# EAGLE design bpf (EAGLE 9.6.2)
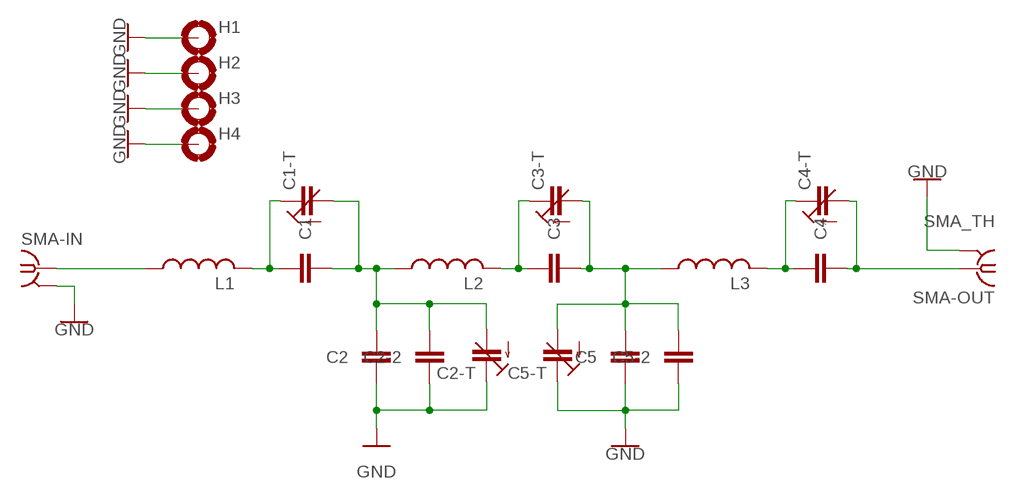
[diagram p0: schematic, sheet 1]

## Parts
C1  C_0805_PTH  [C0805K]
C1-T  C_TRIM_TH  [CTRIM3050.505]
C2  C_0805_PTH  [C0805K]
C2-2  C_0805_PTH  [C0805K]
C2-T  C_TRIM_TH  [CTRIM3050.505]
C3  C_0805_PTH  [C0805K]
C3-T  C_TRIM_TH  [CTRIM3050.505]
C4  C_0805_PTH  [C0805K]
C4-T  C_TRIM_TH  [CTRIM3050.505]
C5  C_0805_PTH  [C0805K]
C5-2  C_0805_PTH  [C0805K]
C5-T  C_TRIM_TH  [CTRIM3050.505]
H1  MOUNT-PAD-ROUND3.0  [3,0-PAD]
H2  MOUNT-PAD-ROUND3.0  [3,0-PAD]
H3  MOUNT-PAD-ROUND3.0  [3,0-PAD]
H4  MOUNT-PAD-ROUND3.0  [3,0-PAD]
L1  L_0805_PTH  [M0805]
L2  L_0805_PTH  [M0805]
L3  L_0805_PTH  [M0805]
SMA-IN  SMA-142-0711-821/826  [J502-ND-142-0711-821/826]
SMA-OUT  SMA_TH  [BU-SMA-V]

## Nets
GND: C2-2.1 C2-2.P$1 C2-T.2(E) C2.1 C2.P$1 C5-2.1 C5-2.P$1 C5-T.2(E) C5.1 C5.P$1 H1.B3,0(MOUNT) H2.B3,0(MOUNT) H3.B3,0(MOUNT) H4.B3,0(MOUNT) SMA-IN.G@1 SMA-IN.G@2 SMA-IN.G@3 SMA-IN.G@4 SMA-OUT.2(GND) SMA-OUT.3(GND) SMA-OUT.4(GND) SMA-OUT.5(GND)
N$1: L1.1 L1.P$1 SMA-IN.1
N$2: C1-T.2(E) C1.1 C1.P$1 L1.2 L1.P$2
N$3: C1-T.1(A) C1.2 C1.P$2 C2-2.2 C2-2.P$2 C2-T.1(A) C2.2 C2.P$2 L2.1 L2.P$1
N$4: C3-T.2(E) C3.1 C3.P$1 L2.2 L2.P$2
N$5: C3-T.1(A) C3.2 C3.P$2 C5-2.2 C5-2.P$2 C5-T.1(A) C5.2 C5.P$2 L3.1 L3.P$1
N$6: C4-T.2(E) C4.1 C4.P$1 L3.2 L3.P$2
N$7: C4-T.1(A) C4.2 C4.P$2 SMA-OUT.1

## Library data of the parts
C1 C2 C2-2 C3-C5 C5-2 = mylib:C_0805_PTH
C1-T C2-T C3-T C4-T C5-T = mylib:C_TRIM_TH
H1-H4 = holes:MOUNT-PAD-ROUND: MOUNTING PAD, round
L1-L3 = mylib:L_0805_PTH
SMA-IN = con-coax:SMA-: SMA 50 Ohm End Launch Jack Receptacle - Round Contact Johnson Components Source: www.johnsoncomponents.com .. J502-ND.pdf; MF: JOHNSON COMPONENTS; MPN: 142-0711-821; OC_FARNELL: 1019328; OC_NEWARK: 16F3627
SMA-OUT = mylib:SMA_TH

## Board
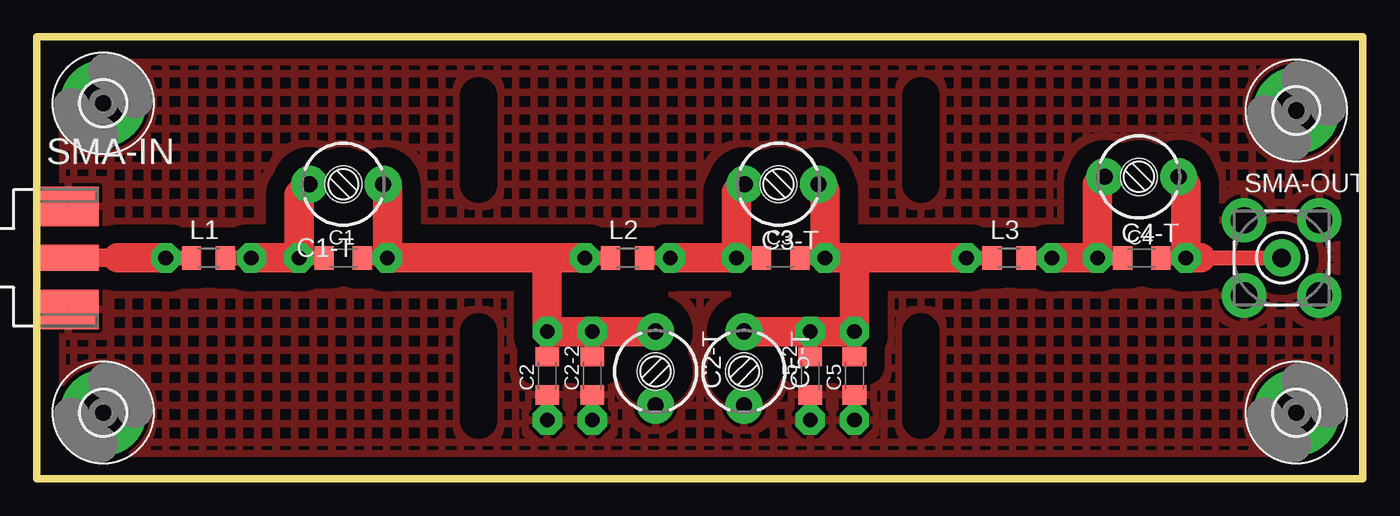
[diagram p1: board, top side]
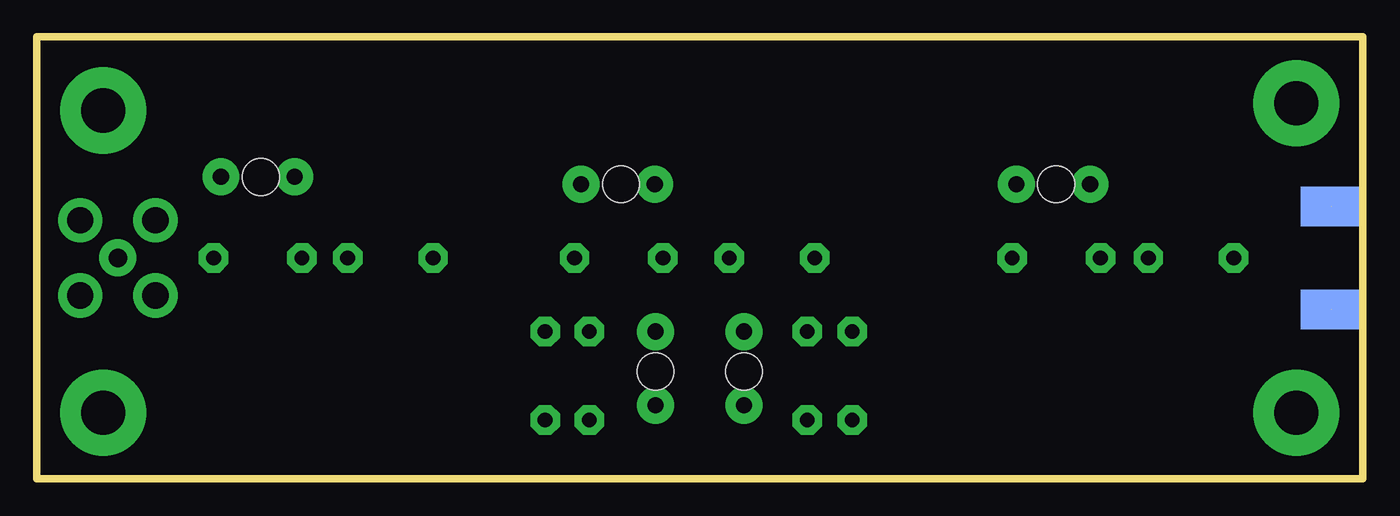
[diagram p2: board, bottom side, seen from below]

Size 90 x 30 mm. Coordinates in mm from the lower left corner, seen from the top.
Outline: 0,0 90,0 90,30 0,30 0,0
Copper layers (1*16): Top 0.035mm / dielectric 1.5mm / Bottom 0.035mm
Design rules "default": minimum track width 6mil, minimum drill 0.35mm, track to track 6mil, track to pad 6mil, pad to pad 6mil, via to via 6mil, smd to smd 6mil, copper to edge 40mil, drill to drill 6mil, minimum pad ring 10mil, minimum via ring 8mil, stop-mask expansion 4mil, vias tented up to drill 0mil, thermal gap 10mil
tRestrict: 4 lines

### Footprints (pad centres in the part's own frame; a part is rotated, then mirrored left to right if it is on the bottom)
C0805K = smd 1.3 x 1.6: 1 -1.3,0; 2 1.3,0 | drill 1 pad 2 octagon: P$1 -3,0; P$2 3,0
CTRIM3050.505 = drill 1.1 pad 2.5: 1 -2.5,0; 2 2.5,0 | hole 2.5: 0.2,0
3,0-PAD = drill 3 pad 5.842: B3,0 0,0
M0805 = smd 1.3 x 1.6: 1 -1.15,0; 2 1.15,0 | drill 1 pad 2 octagon: P$1 -2.9,0; P$2 2.9,0
J502-ND-142-0711-821/826 = smd 4.191 x 1.778: 1 2.115,0 | smd 4.191 x 2.667: G@1 2.115,3.495; G@2 2.115,-3.495 | smd 4.191 x 2.667 bottom: G@3 2.115,3.495; G@4 2.115,-3.495
BU-SMA-V = drill 1.27 pad 2.5: 1 0,0 | drill 1.778 pad 3: 2 -2.55,2.55; 3 2.55,2.55; 4 2.55,-2.55; 5 -2.55,-2.55

### Placement (x,y rotation side)
C1  20.8,15 0 top
C1-T  21,20 180 top
C2  34.65,7 90 top
C2-2  37.7,7 90 top
C2-T  42,7.5 270 top
C3  50.5,15 0 top
C3-T  50.55,20 180 top
C4  75,15 0 top
C4-T  75,20.5 180 top
C5  55.5,7 90 top
C5-2  52.5,7 90 top
C5-T  48,7.5 270 top
H1  4.5,4.5 0 top
H2  4.5,25.5 0 top
H3  85.5,4.5 0 top
H4  85.5,25 0 top
L1  11.65,15 0 top
L2  40.1,15 0 top
L3  66,15 0 top
SMA-IN  0,15 0 top
SMA-OUT  84.5,15 0 top

### Tracks (layer width: path | path; a pad name or v marks a point on that pad's centre or on a via)
GND  (2 unrouted)
  pour Top (isolate 1.25, hatched): 92,-2 -2,-2 -2,32 92,32
N$1
  Top 1.016: L1.P$1 L1.1
  Top 1.27: SMA-IN.1 5.5,15
  Top 2: 5.5,15 L1.P$1
N$2
  Top 1.016: L1.2 L1.P$2 | C1.P$1 C1.1
  Top 2: L1.P$2 C1.P$1 17.8,19.3 C1-T.2
N$3
  Top 1.016: C1.2 C1.P$2 | L2.P$1 L2.1 | C2.P$2 C2.2 | C2-2.P$2 C2-2.2
  Top 2: 34.5,15 C1.P$2 23.8,19.7 C1-T.1 | 34.5,15 L2.P$1 | 34.5,15 34.65,14.85 C2.P$2 C2-2.P$2 C2-T.1
N$4
  Top 1.016: L2.2 L2.P$2 | C3.P$1 C3.1
  Top 2: L2.P$2 C3.P$1 47.5,19.45 C3-T.2
N$5
  Top 1.016: C3.2 C3.P$2 | C5-2.2 C5-2.P$2 | C5.2 C5.P$2 | L3.P$1 L3.1
  Top 2: C5-T.1 C5-2.P$2 C5.P$2 55.5,15 | 55.5,15 C3.P$2 53.5,19.55 C3-T.1 | 55.5,15 L3.P$1
N$6
  Top 1.016: L3.2 L3.P$2 | C4.P$1 C4.1
  Top 2: L3.P$2 C4.P$1 72,20 C4-T.2
N$7
  Top 1.016: 79,15 SMA-OUT.1 | C4.2 C4.P$2
  Top 2: 79,15 C4.P$2 78,20 C4-T.1